# Altium schematic sheet Power Circuitry.SchDoc
size A4; SheetNumber: 4; SheetTotal: 6
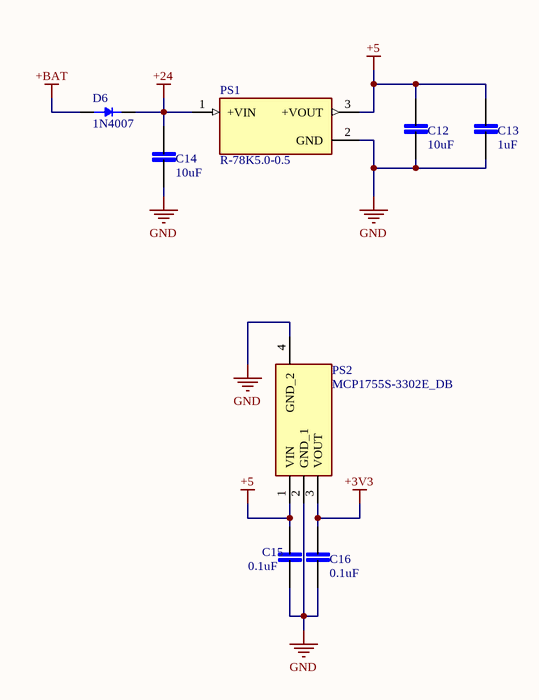
[diagram p0: Power Circuitry.SchDoc]

## Parts
C12  10uF  [0805]
C13  1uF  [0805]
C14  10uF  [0805]
C15  0.1uF  [0805]
C16  0.1uF  [0805]
D6  1N4007  [SOD123]
PS1  R-78K5.0-0.5  [CONV_R-78K5.0-0.5]
PS2  MCP1755S-3302E_DB  [MCP1755S-3302E_DB]

## Nets
+3V3: C16.2 PS2.3(VOUT)
+5: C12.2 C13.2 C15.2 PS1.3(+VOUT) PS2.1(VIN)
+24: C14.2 D6.2(A) PS1.1(+VIN)
+BAT: D6.1(K)
GND: C12.1 C13.1 C14.1 C15.1 C16.1 PS1.2(GND) PS2.2(GND_1) PS2.4(GND_2)

## Library data of the parts
C12-C16 = 0805_Capacitor: MP: LD051A121KAB2A; MF: AVX; SnapEDA_Link: https://www.snapeda.com/parts/LD051A121KAB2A/AVX/view-part/?ref=snap; Package: 0805 AVX; Check_prices: https://www.snapeda.com/parts/LD051A121KAB2A/AVX/view-part/?ref=eda; Purchase-URL: https://pricing.snapeda.com/search/part/LD051A121KAB2A/?ref=eda; Price: None; Value: *; Availability: In Stock
D6 = SOD123 - Rectifier Diode: MF: Diodes Inc.; MP: 1N4148W-7-F; Value: *; Availability: In Stock; Package: SOD-123 Fairchild Semiconductor; SnapEDA_Link: https://www.snapeda.com/parts/1N4148W-7-F/Diodes+Inc./view-part/?ref=snap; Price: None; Check_prices: https://www.snapeda.com/parts/1N4148W-7-F/Diodes+Inc./view-part/?ref=eda; Purchase-URL: https://pricing.snapeda.com/search/part/1N4148W-7-F/?ref=eda
PS1 = R-78K5.0-0.5: 0.5A DC/DC-Converter 'INNOLINE' SIP3 reg; MF: Recom Power; Package: None; Value: *; Check_prices: https://www.snapeda.com/parts/R-78K5.0-0.5/Recom+Power/view-part/?ref=eda; Purchase-URL: https://pricing.snapeda.com/search/part/R-78K5.0-0.5/?ref=eda; Availability: In Stock; SnapEDA_Link: https://www.snapeda.com/parts/R-78K5.0-0.5/Recom+Power/view-part/?ref=snap; Price: None; MP: R-78K5.0-0.5
PS2 = MCP1755S-3302E_DB: Power Supply; Manufacturer_Name: Microchip; Manufacturer_Part_Number: MCP1755S-3302E/DB; Datasheet Link: http://www.farnell.com/datasheets/1697992.pdf; Height: 1.8mm; Mouser Part Number: 579-MCP1755S-3302EDB; Mouser Price/Stock: https://www.mouser.co.uk/ProductDetail/Microchip-Technology/MCP1755S-3302E-DB?qs=OCR3PNzn1cc7Hxpx9CIZgA%3D%3D; Arrow Part Number: MCP1755S-3302E/DB; Arrow Price/Stock: https://www.arrow.com/en/products/mcp1755s-3302edb/microchip-technology?region=nac